# Altium schematic sheet AmpliHugo.SchDoc
size A4
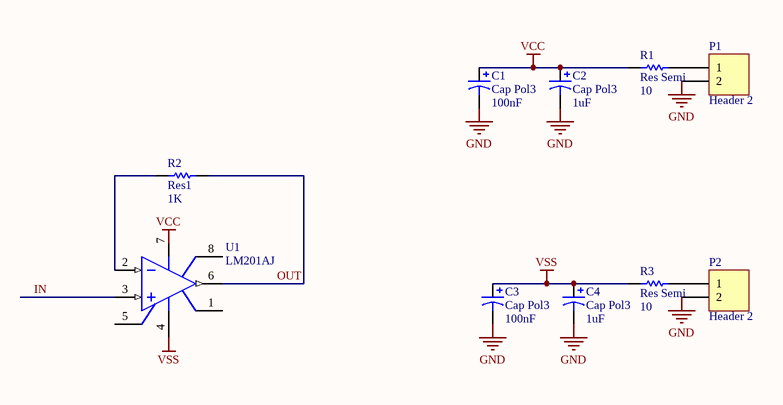
[diagram p0: AmpliHugo.SchDoc]

## Parts
C1  Cap Pol3  value 100nF  [C0805]
C2  Cap Pol3  value 1uF  [C0805]
C3  Cap Pol3  value 100nF  [C0805]
C4  Cap Pol3  value 1uF  [C0805]
P1  Header 2  [HDR1X2]
P2  Header 2  [HDR1X2]
R1  Res Semi  value 10  [2012[0805]]
R2  Res1  value 1K  [AXIAL-0.3]
R3  Res Semi  value 10  [2012[0805]]
U1  LM201AJ  [693-02]

## Nets
GND: C1.2 C2.2 C3.2 C4.2 P1.2 P2.2
VCC: C1.1 C2.1 R1.1
VSS: C3.1 C4.1 R3.1 U1.4(V-)
IN: U1.3(IN+)
OUT: R2.2 U1.6(OUT)
NetP1_1: P1.1 R1.2
NetP2_1: P2.1 R3.2
NetR2_1: R2.1 U1.2(IN-)

Not connected (* = marked no-connect by the designer): U1 1(BAL) 5(BAL) 7(V+) 8(CMPEN)

## Notes on the sheet
- Labels drawn without touching a wire or pin: VCC

## Library data of the parts
C1-C4 = Cap Pol3: Polarized Capacitor (Surface Mount); Published: 8-Jun-2000; LatestRevisionDate: 17-Jul-2002; LatestRevisionNote: Re-released for DXP Platform.; PackageReference: C0805; Publisher: Altium Limited
P1 P2 = Header 2: Header, 2-Pin; LatestRevisionDate: 17-Jul-2002; LatestRevisionNote: Re-released for DXP Platform.; Publisher: Altium Limited
R1 R3 = Res Semi: Semiconductor Resistor; Published: 8-Jun-2000; LatestRevisionDate: 17-Jul-2002; LatestRevisionNote: Re-released for DXP Platform.; PackageReference: AXIAL-0.5; Publisher: Altium Limited
R2 = Res1: Resistor; Published: 8-Jun-2000; LatestRevisionDate: 17-Jul-2002; LatestRevisionNote: Re-released for DXP Platform.; PackageReference: AXIAL-0.3; Publisher: Altium Limited
U1 = LM201AJ: General-Purpose Adjustable Operational Amplifier; Published: 17-Jul-2002; LatestRevisionDate: 06-Jun-2005; LatestRevisionNote: Stylized 3D Model Added.; DatasheetVersion: 1988; PackageReference: 693-02; Publisher: Altium Limited; PackageDescription: DIP; 8 Leads; Row Spacing 7.62 mm; Pitch 2.54 mm; Code_JEDEC: MO-001-AN; ComponentLink1Description: Manufacturer Link; ComponentLink1URL: http://www.onsemi.com/site/products/parametrics/0,4446,251,00.html